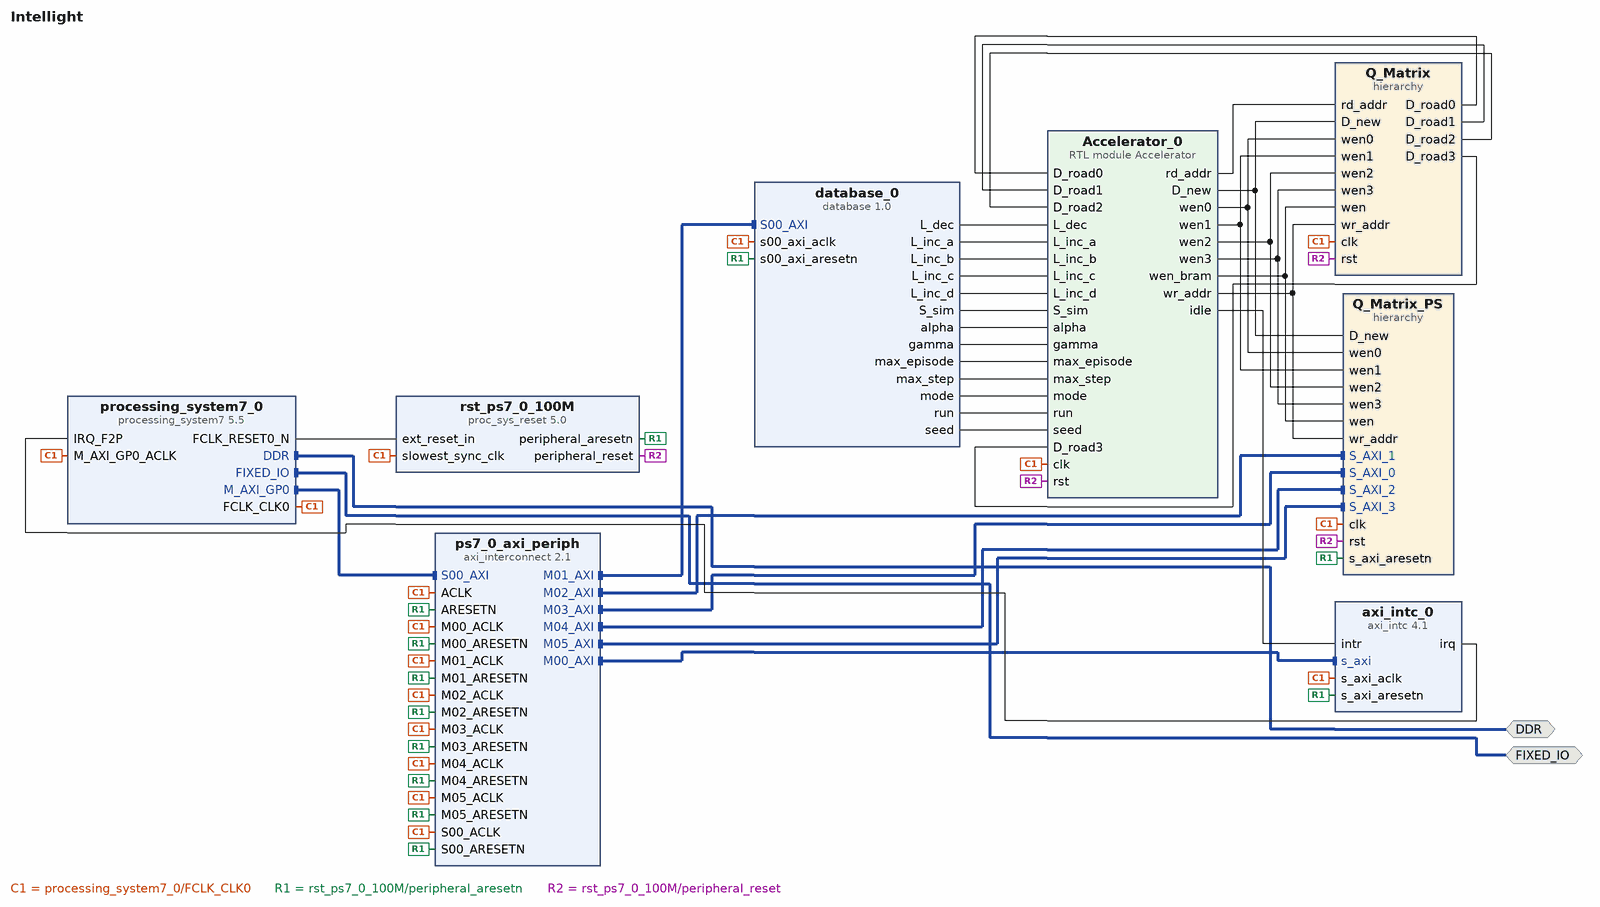
[diagram p0: block diagram of the top level]
# Vivado block design Intellight, xc7z020clg400-1, Vivado 2022.1
create_bd_design Intellight

create_bd_intf_port -mode Master -vlnv xilinx.com:interface:ddrx_rtl:1.0 DDR
create_bd_intf_port -mode Master -vlnv xilinx.com:display_processing_system7:fixedio_rtl:1.0 FIXED_IO

create_bd_cell -type hier Q_Matrix
create_bd_cell -type ip -vlnv xilinx.com:ip:axi_intc:4.1 axi_intc_0
set_property -dict {CONFIG.C_IRQ_CONNECTION 1} [get_bd_cells axi_intc_0]
create_bd_cell -type ip -vlnv xilinx.com:user:database:1.0 database_0
create_bd_cell -type ip -vlnv xilinx.com:ip:processing_system7:5.5 processing_system7_0
set_property -dict [list \
  CONFIG.PCW_APU_PERIPHERAL_FREQMHZ 650 \
  CONFIG.PCW_CRYSTAL_PERIPHERAL_FREQMHZ 50 \
  CONFIG.PCW_ENET0_ENET0_IO {MIO 16 .. 27} \
  CONFIG.PCW_ENET0_GRP_MDIO_ENABLE 1 \
  CONFIG.PCW_ENET0_GRP_MDIO_IO {MIO 52 .. 53} \
  CONFIG.PCW_ENET0_PERIPHERAL_ENABLE 1 \
  CONFIG.PCW_ENET0_RESET_ENABLE 1 \
  CONFIG.PCW_ENET0_RESET_IO {MIO 9} \
  CONFIG.PCW_ENET_RESET_ENABLE 1 \
  CONFIG.PCW_ENET_RESET_SELECT {Share reset pin} \
  CONFIG.PCW_FPGA0_PERIPHERAL_FREQMHZ 100 \
  CONFIG.PCW_FPGA1_PERIPHERAL_FREQMHZ 50 \
  CONFIG.PCW_GPIO_MIO_GPIO_ENABLE 1 \
  CONFIG.PCW_GPIO_MIO_GPIO_IO MIO \
  CONFIG.PCW_I2C_RESET_ENABLE 1 \
  CONFIG.PCW_IRQ_F2P_INTR 1 \
  CONFIG.PCW_M_AXI_GP0_FREQMHZ 10 \
  CONFIG.PCW_PERIPHERAL_BOARD_PRESET None \
  CONFIG.PCW_PRESET_BANK1_VOLTAGE {LVCMOS 1.8V} \
  CONFIG.PCW_QSPI_GRP_FBCLK_ENABLE 1 \
  CONFIG.PCW_QSPI_GRP_FBCLK_IO {MIO 8} \
  CONFIG.PCW_QSPI_GRP_SINGLE_SS_ENABLE 1 \
  CONFIG.PCW_QSPI_GRP_SINGLE_SS_IO {MIO 1 .. 6} \
  CONFIG.PCW_QSPI_PERIPHERAL_ENABLE 1 \
  CONFIG.PCW_QSPI_QSPI_IO {MIO 1 .. 6} \
  CONFIG.PCW_SD0_GRP_CD_ENABLE 1 \
  CONFIG.PCW_SD0_GRP_CD_IO {MIO 47} \
  CONFIG.PCW_SD0_GRP_WP_ENABLE 0 \
  CONFIG.PCW_SD0_PERIPHERAL_ENABLE 1 \
  CONFIG.PCW_SD0_SD0_IO {MIO 40 .. 45} \
  CONFIG.PCW_SDIO_PERIPHERAL_FREQMHZ 50 \
  CONFIG.PCW_SINGLE_QSPI_DATA_MODE x4 \
  CONFIG.PCW_UART0_PERIPHERAL_ENABLE 1 \
  CONFIG.PCW_UART0_UART0_IO {MIO 14 .. 15} \
  CONFIG.PCW_UART1_PERIPHERAL_ENABLE 0 \
  CONFIG.PCW_UART_PERIPHERAL_FREQMHZ 100 \
  CONFIG.PCW_UIPARAM_DDR_BUS_WIDTH {16 Bit} \
  CONFIG.PCW_UIPARAM_DDR_FREQ_MHZ 525 \
  CONFIG.PCW_UIPARAM_DDR_PARTNO {MT41J256M16 RE-125} \
  CONFIG.PCW_USB0_PERIPHERAL_ENABLE 1 \
  CONFIG.PCW_USB0_RESET_ENABLE 1 \
  CONFIG.PCW_USB0_RESET_IO {MIO 46} \
  CONFIG.PCW_USB0_USB0_IO {MIO 28 .. 39} \
  CONFIG.PCW_USB_RESET_ENABLE 1 \
  CONFIG.PCW_USB_RESET_SELECT {Share reset pin} \
  CONFIG.PCW_USE_FABRIC_INTERRUPT 1 \
] [get_bd_cells processing_system7_0]
# 491 more settings of processing_system7_0 are not shown: defaults, MIO pin electricals, DDR timing, and values the tool derives
create_bd_cell -type ip -vlnv xilinx.com:ip:axi_interconnect:2.1 ps7_0_axi_periph
set_property -dict {CONFIG.NUM_MI 6} [get_bd_cells ps7_0_axi_periph]
create_bd_cell -type ip -vlnv xilinx.com:ip:proc_sys_reset:5.0 rst_ps7_0_100M
create_bd_cell -type hier Q_Matrix_PS
create_bd_cell -type module -reference Accelerator Accelerator_0

# ---- hierarchy /Q_Matrix ----
current_bd_instance /Q_Matrix
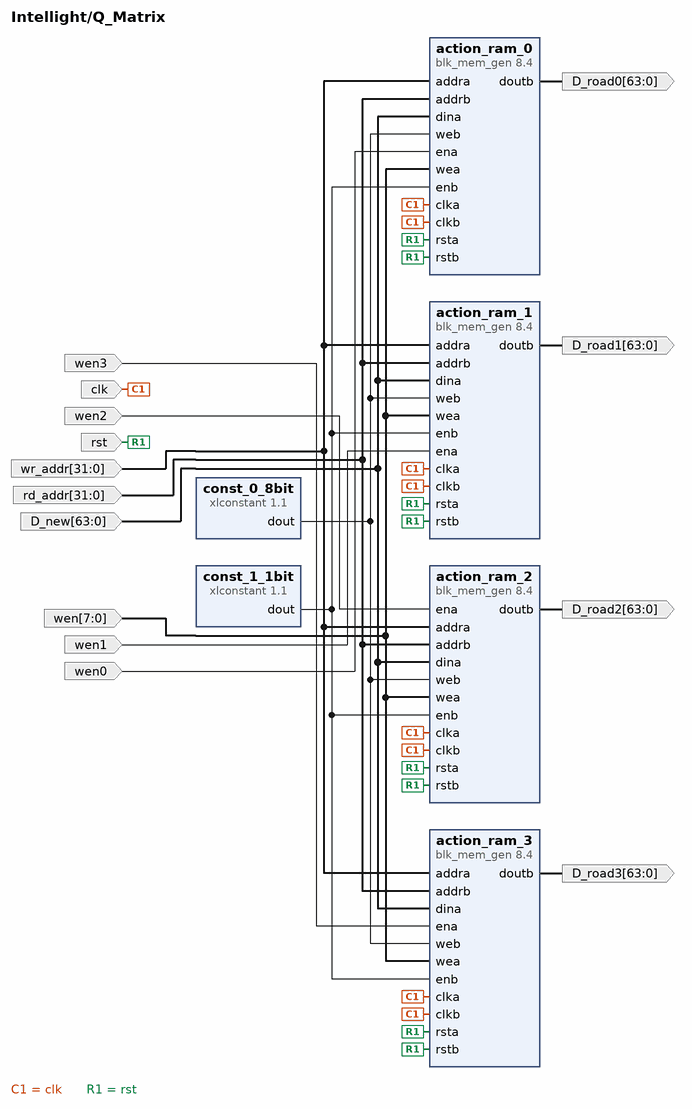
[diagram p1: block diagram inside /Q_Matrix]
create_bd_pin -dir I -type clk clk
create_bd_pin -dir I -type rst rst
create_bd_pin -dir I wen0
create_bd_pin -dir I -from 7 -to 0 wen
create_bd_pin -dir I -from 31 -to 0 wr_addr
create_bd_pin -dir I -from 63 -to 0 D_new
create_bd_pin -dir I -from 31 -to 0 rd_addr
create_bd_pin -dir O -from 63 -to 0 D_road0
create_bd_pin -dir I wen1
create_bd_pin -dir O -from 63 -to 0 D_road1
create_bd_pin -dir I wen2
create_bd_pin -dir O -from 63 -to 0 D_road2
create_bd_pin -dir I wen3
create_bd_pin -dir O -from 63 -to 0 D_road3

create_bd_cell -type ip -vlnv xilinx.com:ip:blk_mem_gen:8.4 action_ram_0
set_property -dict [list \
  CONFIG.Assume_Synchronous_Clk true \
  CONFIG.EN_SAFETY_CKT true \
  CONFIG.Enable_32bit_Address true \
  CONFIG.Enable_B Use_ENB_Pin \
  CONFIG.Memory_Type True_Dual_Port_RAM \
  CONFIG.Operating_Mode_A WRITE_FIRST \
  CONFIG.Operating_Mode_B WRITE_FIRST \
  CONFIG.Port_B_Clock 100 \
  CONFIG.Port_B_Enable_Rate 100 \
  CONFIG.Port_B_Write_Rate 50 \
  CONFIG.Read_Width_A 64 \
  CONFIG.Read_Width_B 64 \
  CONFIG.Register_PortA_Output_of_Memory_Primitives false \
  CONFIG.Register_PortB_Output_of_Memory_Primitives false \
  CONFIG.Use_RSTA_Pin true \
  CONFIG.Use_RSTB_Pin true \
  CONFIG.Write_Depth_A 256 \
  CONFIG.Write_Width_A 64 \
  CONFIG.Write_Width_B 64 \
  CONFIG.use_bram_block Stand_Alone \
] [get_bd_cells action_ram_0]
create_bd_cell -type ip -vlnv xilinx.com:ip:blk_mem_gen:8.4 action_ram_1
set_property -dict [list \
  CONFIG.Assume_Synchronous_Clk true \
  CONFIG.EN_SAFETY_CKT true \
  CONFIG.Enable_32bit_Address true \
  CONFIG.Enable_B Use_ENB_Pin \
  CONFIG.Memory_Type True_Dual_Port_RAM \
  CONFIG.Operating_Mode_A READ_FIRST \
  CONFIG.Operating_Mode_B READ_FIRST \
  CONFIG.Port_B_Clock 100 \
  CONFIG.Port_B_Enable_Rate 100 \
  CONFIG.Port_B_Write_Rate 50 \
  CONFIG.Read_Width_A 64 \
  CONFIG.Read_Width_B 64 \
  CONFIG.Register_PortA_Output_of_Memory_Primitives false \
  CONFIG.Register_PortB_Output_of_Memory_Primitives false \
  CONFIG.Use_RSTA_Pin true \
  CONFIG.Use_RSTB_Pin true \
  CONFIG.Write_Depth_A 256 \
  CONFIG.Write_Width_A 64 \
  CONFIG.Write_Width_B 64 \
  CONFIG.use_bram_block Stand_Alone \
] [get_bd_cells action_ram_1]
create_bd_cell -type ip -vlnv xilinx.com:ip:blk_mem_gen:8.4 action_ram_2
set_property -dict [list \
  CONFIG.Assume_Synchronous_Clk true \
  CONFIG.EN_SAFETY_CKT true \
  CONFIG.Enable_32bit_Address true \
  CONFIG.Enable_B Use_ENB_Pin \
  CONFIG.Memory_Type True_Dual_Port_RAM \
  CONFIG.Operating_Mode_A READ_FIRST \
  CONFIG.Operating_Mode_B READ_FIRST \
  CONFIG.Port_B_Clock 100 \
  CONFIG.Port_B_Enable_Rate 100 \
  CONFIG.Port_B_Write_Rate 50 \
  CONFIG.Read_Width_A 64 \
  CONFIG.Read_Width_B 64 \
  CONFIG.Register_PortA_Output_of_Memory_Primitives false \
  CONFIG.Register_PortB_Output_of_Memory_Primitives false \
  CONFIG.Use_RSTA_Pin true \
  CONFIG.Use_RSTB_Pin true \
  CONFIG.Write_Depth_A 256 \
  CONFIG.Write_Width_A 64 \
  CONFIG.Write_Width_B 64 \
  CONFIG.use_bram_block Stand_Alone \
] [get_bd_cells action_ram_2]
create_bd_cell -type ip -vlnv xilinx.com:ip:blk_mem_gen:8.4 action_ram_3
set_property -dict [list \
  CONFIG.Assume_Synchronous_Clk true \
  CONFIG.EN_SAFETY_CKT true \
  CONFIG.Enable_32bit_Address true \
  CONFIG.Enable_B Use_ENB_Pin \
  CONFIG.Memory_Type True_Dual_Port_RAM \
  CONFIG.Operating_Mode_A READ_FIRST \
  CONFIG.Operating_Mode_B READ_FIRST \
  CONFIG.Port_B_Clock 100 \
  CONFIG.Port_B_Enable_Rate 100 \
  CONFIG.Port_B_Write_Rate 50 \
  CONFIG.Read_Width_A 64 \
  CONFIG.Read_Width_B 64 \
  CONFIG.Register_PortA_Output_of_Memory_Primitives false \
  CONFIG.Register_PortB_Output_of_Memory_Primitives false \
  CONFIG.Use_RSTA_Pin true \
  CONFIG.Use_RSTB_Pin true \
  CONFIG.Write_Depth_A 256 \
  CONFIG.Write_Width_A 64 \
  CONFIG.Write_Width_B 64 \
  CONFIG.use_bram_block Stand_Alone \
] [get_bd_cells action_ram_3]
create_bd_cell -type ip -vlnv xilinx.com:ip:xlconstant:1.1 const_1_1bit
create_bd_cell -type ip -vlnv xilinx.com:ip:xlconstant:1.1 const_0_8bit
set_property -dict {CONFIG.CONST_VAL 0 CONFIG.CONST_WIDTH 8} [get_bd_cells const_0_8bit]

# ---- hierarchy /Q_Matrix_PS ----
current_bd_instance /Q_Matrix_PS
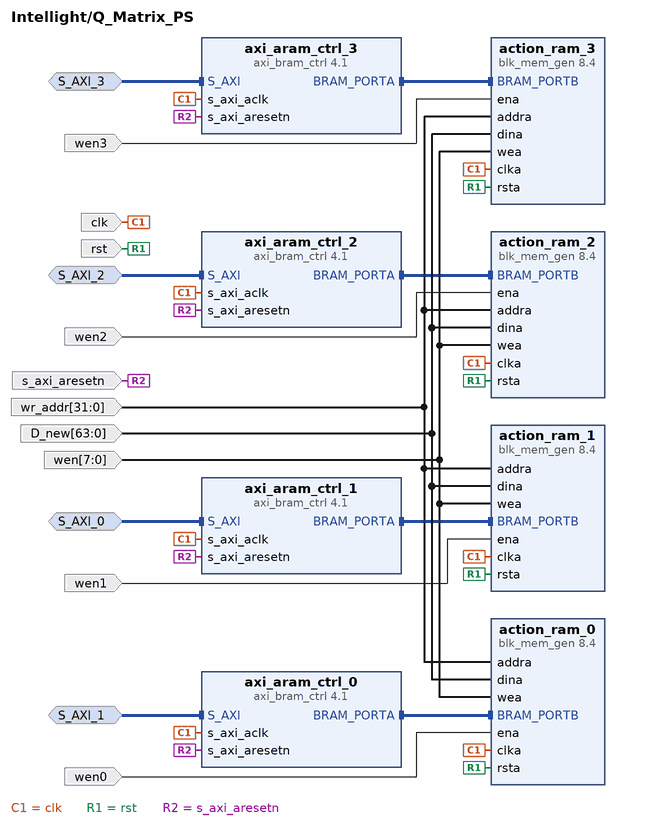
[diagram p2: block diagram inside /Q_Matrix_PS]
create_bd_intf_pin -mode Slave -vlnv xilinx.com:interface:aximm_rtl:1.0 S_AXI_0
create_bd_intf_pin -mode Slave -vlnv xilinx.com:interface:aximm_rtl:1.0 S_AXI_1
create_bd_intf_pin -mode Slave -vlnv xilinx.com:interface:aximm_rtl:1.0 S_AXI_2
create_bd_intf_pin -mode Slave -vlnv xilinx.com:interface:aximm_rtl:1.0 S_AXI_3
create_bd_pin -dir I -from 63 -to 0 D_new
create_bd_pin -dir I -type clk clk
create_bd_pin -dir I -type rst rst
create_bd_pin -dir I -type rst s_axi_aresetn
create_bd_pin -dir I -from 7 -to 0 wen
create_bd_pin -dir I wen0
create_bd_pin -dir I wen1
create_bd_pin -dir I wen2
create_bd_pin -dir I wen3
create_bd_pin -dir I -from 31 -to 0 wr_addr

create_bd_cell -type ip -vlnv xilinx.com:ip:blk_mem_gen:8.4 action_ram_0
set_property -dict [list \
  CONFIG.Assume_Synchronous_Clk true \
  CONFIG.EN_SAFETY_CKT true \
  CONFIG.Enable_32bit_Address true \
  CONFIG.Enable_B Use_ENB_Pin \
  CONFIG.Memory_Type True_Dual_Port_RAM \
  CONFIG.Operating_Mode_A WRITE_FIRST \
  CONFIG.Operating_Mode_B WRITE_FIRST \
  CONFIG.Port_B_Clock 100 \
  CONFIG.Port_B_Enable_Rate 100 \
  CONFIG.Port_B_Write_Rate 50 \
  CONFIG.Read_Width_A 64 \
  CONFIG.Read_Width_B 64 \
  CONFIG.Register_PortA_Output_of_Memory_Primitives false \
  CONFIG.Register_PortB_Output_of_Memory_Primitives false \
  CONFIG.Use_RSTA_Pin true \
  CONFIG.Use_RSTB_Pin true \
  CONFIG.Write_Width_A 64 \
  CONFIG.Write_Width_B 64 \
  CONFIG.use_bram_block BRAM_Controller \
] [get_bd_cells action_ram_0]
create_bd_cell -type ip -vlnv xilinx.com:ip:blk_mem_gen:8.4 action_ram_1
set_property -dict [list \
  CONFIG.Assume_Synchronous_Clk true \
  CONFIG.EN_SAFETY_CKT true \
  CONFIG.Enable_32bit_Address true \
  CONFIG.Enable_B Use_ENB_Pin \
  CONFIG.Memory_Type True_Dual_Port_RAM \
  CONFIG.Operating_Mode_A WRITE_FIRST \
  CONFIG.Operating_Mode_B WRITE_FIRST \
  CONFIG.Port_B_Clock 100 \
  CONFIG.Port_B_Enable_Rate 100 \
  CONFIG.Port_B_Write_Rate 50 \
  CONFIG.Read_Width_A 64 \
  CONFIG.Read_Width_B 64 \
  CONFIG.Register_PortA_Output_of_Memory_Primitives false \
  CONFIG.Register_PortB_Output_of_Memory_Primitives false \
  CONFIG.Use_RSTA_Pin true \
  CONFIG.Use_RSTB_Pin true \
  CONFIG.Write_Width_A 64 \
  CONFIG.Write_Width_B 64 \
  CONFIG.use_bram_block BRAM_Controller \
] [get_bd_cells action_ram_1]
create_bd_cell -type ip -vlnv xilinx.com:ip:blk_mem_gen:8.4 action_ram_2
set_property -dict [list \
  CONFIG.Assume_Synchronous_Clk true \
  CONFIG.EN_SAFETY_CKT true \
  CONFIG.Enable_32bit_Address true \
  CONFIG.Enable_B Use_ENB_Pin \
  CONFIG.Memory_Type True_Dual_Port_RAM \
  CONFIG.Operating_Mode_A WRITE_FIRST \
  CONFIG.Operating_Mode_B WRITE_FIRST \
  CONFIG.Port_B_Clock 100 \
  CONFIG.Port_B_Enable_Rate 100 \
  CONFIG.Port_B_Write_Rate 50 \
  CONFIG.Read_Width_A 64 \
  CONFIG.Read_Width_B 64 \
  CONFIG.Register_PortA_Output_of_Memory_Primitives false \
  CONFIG.Register_PortB_Output_of_Memory_Primitives false \
  CONFIG.Use_RSTA_Pin true \
  CONFIG.Use_RSTB_Pin true \
  CONFIG.Write_Width_A 64 \
  CONFIG.Write_Width_B 64 \
  CONFIG.use_bram_block BRAM_Controller \
] [get_bd_cells action_ram_2]
create_bd_cell -type ip -vlnv xilinx.com:ip:blk_mem_gen:8.4 action_ram_3
set_property -dict [list \
  CONFIG.Assume_Synchronous_Clk true \
  CONFIG.EN_SAFETY_CKT true \
  CONFIG.Enable_32bit_Address true \
  CONFIG.Enable_B Use_ENB_Pin \
  CONFIG.Memory_Type True_Dual_Port_RAM \
  CONFIG.Operating_Mode_A WRITE_FIRST \
  CONFIG.Operating_Mode_B WRITE_FIRST \
  CONFIG.Port_B_Clock 100 \
  CONFIG.Port_B_Enable_Rate 100 \
  CONFIG.Port_B_Write_Rate 50 \
  CONFIG.Read_Width_A 64 \
  CONFIG.Read_Width_B 64 \
  CONFIG.Register_PortA_Output_of_Memory_Primitives false \
  CONFIG.Register_PortB_Output_of_Memory_Primitives false \
  CONFIG.Use_RSTA_Pin true \
  CONFIG.Use_RSTB_Pin true \
  CONFIG.Write_Width_A 64 \
  CONFIG.Write_Width_B 64 \
  CONFIG.use_bram_block BRAM_Controller \
] [get_bd_cells action_ram_3]
create_bd_cell -type ip -vlnv xilinx.com:ip:axi_bram_ctrl:4.1 axi_aram_ctrl_0
set_property -dict {CONFIG.DATA_WIDTH 64 CONFIG.SINGLE_PORT_BRAM 1} [get_bd_cells axi_aram_ctrl_0]
create_bd_cell -type ip -vlnv xilinx.com:ip:axi_bram_ctrl:4.1 axi_aram_ctrl_1
set_property -dict {CONFIG.DATA_WIDTH 64 CONFIG.SINGLE_PORT_BRAM 1} [get_bd_cells axi_aram_ctrl_1]
create_bd_cell -type ip -vlnv xilinx.com:ip:axi_bram_ctrl:4.1 axi_aram_ctrl_2
set_property -dict {CONFIG.DATA_WIDTH 64 CONFIG.SINGLE_PORT_BRAM 1} [get_bd_cells axi_aram_ctrl_2]
create_bd_cell -type ip -vlnv xilinx.com:ip:axi_bram_ctrl:4.1 axi_aram_ctrl_3
set_property -dict {CONFIG.DATA_WIDTH 64 CONFIG.SINGLE_PORT_BRAM 1} [get_bd_cells axi_aram_ctrl_3]

# ---- connections ----

current_bd_instance /Q_Matrix
connect_bd_net [get_bd_pins action_ram_0/doutb] [get_bd_pins D_road0]
connect_bd_net [get_bd_pins action_ram_1/doutb] [get_bd_pins D_road1]
connect_bd_net [get_bd_pins action_ram_2/doutb] [get_bd_pins D_road2]
connect_bd_net [get_bd_pins action_ram_3/doutb] [get_bd_pins D_road3]
connect_bd_net -net addra_0_1 [get_bd_pins wr_addr] \
  [get_bd_pins action_ram_1/addra] [get_bd_pins action_ram_2/addra] [get_bd_pins action_ram_3/addra] \
  [get_bd_pins action_ram_0/addra]
connect_bd_net -net addrb_0_1 [get_bd_pins rd_addr] \
  [get_bd_pins action_ram_1/addrb] [get_bd_pins action_ram_2/addrb] [get_bd_pins action_ram_3/addrb] \
  [get_bd_pins action_ram_0/addrb]
connect_bd_net -net clka_0_1 [get_bd_pins clk] \
  [get_bd_pins action_ram_0/clkb] [get_bd_pins action_ram_1/clka] [get_bd_pins action_ram_1/clkb] \
  [get_bd_pins action_ram_2/clka] [get_bd_pins action_ram_2/clkb] [get_bd_pins action_ram_3/clka] \
  [get_bd_pins action_ram_3/clkb] [get_bd_pins action_ram_0/clka]
connect_bd_net -net const_0_4bit_dout [get_bd_pins const_0_8bit/dout] \
  [get_bd_pins action_ram_0/web] [get_bd_pins action_ram_1/web] [get_bd_pins action_ram_2/web] [get_bd_pins action_ram_3/web]
connect_bd_net -net dina_0_1 [get_bd_pins D_new] \
  [get_bd_pins action_ram_1/dina] [get_bd_pins action_ram_2/dina] [get_bd_pins action_ram_3/dina] \
  [get_bd_pins action_ram_0/dina]
connect_bd_net -net rsta_0_1 [get_bd_pins rst] \
  [get_bd_pins action_ram_0/rstb] [get_bd_pins action_ram_1/rsta] [get_bd_pins action_ram_1/rstb] \
  [get_bd_pins action_ram_2/rsta] [get_bd_pins action_ram_2/rstb] [get_bd_pins action_ram_3/rsta] \
  [get_bd_pins action_ram_3/rstb] [get_bd_pins action_ram_0/rsta]
connect_bd_net -net wea_0_1 [get_bd_pins wen] \
  [get_bd_pins action_ram_1/wea] [get_bd_pins action_ram_2/wea] [get_bd_pins action_ram_3/wea] [get_bd_pins action_ram_0/wea]
connect_bd_net -net wen0_1 [get_bd_pins wen0] [get_bd_pins action_ram_0/ena]
connect_bd_net -net wen1_1 [get_bd_pins wen1] [get_bd_pins action_ram_1/ena]
connect_bd_net -net wen2_1 [get_bd_pins wen2] [get_bd_pins action_ram_2/ena]
connect_bd_net -net wen3_1 [get_bd_pins wen3] [get_bd_pins action_ram_3/ena]
connect_bd_net -net xlconstant_0_dout [get_bd_pins const_1_1bit/dout] \
  [get_bd_pins action_ram_0/enb] [get_bd_pins action_ram_1/enb] [get_bd_pins action_ram_2/enb] [get_bd_pins action_ram_3/enb]

current_bd_instance /Q_Matrix_PS
connect_bd_intf_net -intf_net S_AXI_0_1 [get_bd_intf_pins S_AXI_0] [get_bd_intf_pins axi_aram_ctrl_1/S_AXI]
connect_bd_intf_net -intf_net S_AXI_1_1 [get_bd_intf_pins S_AXI_1] [get_bd_intf_pins axi_aram_ctrl_0/S_AXI]
connect_bd_intf_net -intf_net S_AXI_2_1 [get_bd_intf_pins S_AXI_2] [get_bd_intf_pins axi_aram_ctrl_2/S_AXI]
connect_bd_intf_net -intf_net S_AXI_3_1 [get_bd_intf_pins S_AXI_3] [get_bd_intf_pins axi_aram_ctrl_3/S_AXI]
connect_bd_intf_net [get_bd_intf_pins action_ram_0/BRAM_PORTB] [get_bd_intf_pins axi_aram_ctrl_0/BRAM_PORTA]
connect_bd_intf_net [get_bd_intf_pins action_ram_1/BRAM_PORTB] [get_bd_intf_pins axi_aram_ctrl_1/BRAM_PORTA]
connect_bd_intf_net [get_bd_intf_pins action_ram_2/BRAM_PORTB] [get_bd_intf_pins axi_aram_ctrl_2/BRAM_PORTA]
connect_bd_intf_net [get_bd_intf_pins action_ram_3/BRAM_PORTB] [get_bd_intf_pins axi_aram_ctrl_3/BRAM_PORTA]
connect_bd_net -net addra_0_1 [get_bd_pins wr_addr] \
  [get_bd_pins action_ram_0/addra] [get_bd_pins action_ram_1/addra] [get_bd_pins action_ram_2/addra] \
  [get_bd_pins action_ram_3/addra]
connect_bd_net -net clka_0_1 [get_bd_pins clk] \
  [get_bd_pins action_ram_0/clka] [get_bd_pins action_ram_1/clka] [get_bd_pins action_ram_2/clka] \
  [get_bd_pins action_ram_3/clka] [get_bd_pins axi_aram_ctrl_0/s_axi_aclk] [get_bd_pins axi_aram_ctrl_1/s_axi_aclk] \
  [get_bd_pins axi_aram_ctrl_2/s_axi_aclk] [get_bd_pins axi_aram_ctrl_3/s_axi_aclk]
connect_bd_net -net dina_0_1 [get_bd_pins D_new] \
  [get_bd_pins action_ram_0/dina] [get_bd_pins action_ram_1/dina] [get_bd_pins action_ram_2/dina] \
  [get_bd_pins action_ram_3/dina]
connect_bd_net -net rsta_0_1 [get_bd_pins rst] \
  [get_bd_pins action_ram_0/rsta] [get_bd_pins action_ram_1/rsta] [get_bd_pins action_ram_2/rsta] \
  [get_bd_pins action_ram_3/rsta]
connect_bd_net [get_bd_pins s_axi_aresetn] \
  [get_bd_pins axi_aram_ctrl_0/s_axi_aresetn] [get_bd_pins axi_aram_ctrl_1/s_axi_aresetn] \
  [get_bd_pins axi_aram_ctrl_2/s_axi_aresetn] [get_bd_pins axi_aram_ctrl_3/s_axi_aresetn]
connect_bd_net -net wea_0_1 [get_bd_pins wen] \
  [get_bd_pins action_ram_0/wea] [get_bd_pins action_ram_1/wea] [get_bd_pins action_ram_2/wea] [get_bd_pins action_ram_3/wea]
connect_bd_net -net wen0_1 [get_bd_pins wen0] [get_bd_pins action_ram_0/ena]
connect_bd_net -net wen1_1 [get_bd_pins wen1] [get_bd_pins action_ram_1/ena]
connect_bd_net -net wen2_1 [get_bd_pins wen2] [get_bd_pins action_ram_2/ena]
connect_bd_net -net wen3_1 [get_bd_pins wen3] [get_bd_pins action_ram_3/ena]
set_property HDL_ATTRIBUTE.BMM_INFO_ADDRESS_SPACE {byte  0x40000000 64 > Intellight Q_Matrix_PS/action_ram_0} [get_bd_cells axi_aram_ctrl_0]
set_property HDL_ATTRIBUTE.KEEP_HIERARCHY yes [get_bd_cells axi_aram_ctrl_0]
set_property HDL_ATTRIBUTE.BMM_INFO_ADDRESS_SPACE {byte  0x42000000 64 > Intellight Q_Matrix_PS/action_ram_1} [get_bd_cells axi_aram_ctrl_1]
set_property HDL_ATTRIBUTE.KEEP_HIERARCHY yes [get_bd_cells axi_aram_ctrl_1]
set_property HDL_ATTRIBUTE.BMM_INFO_ADDRESS_SPACE {byte  0x44000000 64 > Intellight Q_Matrix_PS/action_ram_2} [get_bd_cells axi_aram_ctrl_2]
set_property HDL_ATTRIBUTE.KEEP_HIERARCHY yes [get_bd_cells axi_aram_ctrl_2]
set_property HDL_ATTRIBUTE.BMM_INFO_ADDRESS_SPACE {byte  0x46000000 64 > Intellight Q_Matrix_PS/action_ram_3} [get_bd_cells axi_aram_ctrl_3]
set_property HDL_ATTRIBUTE.KEEP_HIERARCHY yes [get_bd_cells axi_aram_ctrl_3]

current_bd_instance /
connect_bd_intf_net [get_bd_intf_ports DDR] [get_bd_intf_pins processing_system7_0/DDR]
connect_bd_intf_net [get_bd_intf_ports FIXED_IO] [get_bd_intf_pins processing_system7_0/FIXED_IO]
connect_bd_intf_net [get_bd_intf_pins processing_system7_0/M_AXI_GP0] [get_bd_intf_pins ps7_0_axi_periph/S00_AXI]
connect_bd_intf_net [get_bd_intf_pins ps7_0_axi_periph/M00_AXI] [get_bd_intf_pins axi_intc_0/s_axi]
connect_bd_intf_net [get_bd_intf_pins ps7_0_axi_periph/M01_AXI] [get_bd_intf_pins database_0/S00_AXI]
connect_bd_intf_net [get_bd_intf_pins ps7_0_axi_periph/M02_AXI] [get_bd_intf_pins Q_Matrix_PS/S_AXI_1]
connect_bd_intf_net [get_bd_intf_pins ps7_0_axi_periph/M03_AXI] [get_bd_intf_pins Q_Matrix_PS/S_AXI_0]
connect_bd_intf_net [get_bd_intf_pins ps7_0_axi_periph/M04_AXI] [get_bd_intf_pins Q_Matrix_PS/S_AXI_2]
connect_bd_intf_net [get_bd_intf_pins ps7_0_axi_periph/M05_AXI] [get_bd_intf_pins Q_Matrix_PS/S_AXI_3]
connect_bd_net [get_bd_pins Accelerator_0/D_new] [get_bd_pins Q_Matrix/D_new] [get_bd_pins Q_Matrix_PS/D_new]
connect_bd_net [get_bd_pins Accelerator_0/idle] [get_bd_pins axi_intc_0/intr]
connect_bd_net [get_bd_pins Accelerator_0/rd_addr] [get_bd_pins Q_Matrix/rd_addr]
connect_bd_net [get_bd_pins Accelerator_0/wen0] [get_bd_pins Q_Matrix/wen0] [get_bd_pins Q_Matrix_PS/wen0]
connect_bd_net [get_bd_pins Accelerator_0/wen1] [get_bd_pins Q_Matrix/wen1] [get_bd_pins Q_Matrix_PS/wen1]
connect_bd_net [get_bd_pins Accelerator_0/wen2] [get_bd_pins Q_Matrix/wen2] [get_bd_pins Q_Matrix_PS/wen2]
connect_bd_net [get_bd_pins Accelerator_0/wen3] [get_bd_pins Q_Matrix/wen3] [get_bd_pins Q_Matrix_PS/wen3]
connect_bd_net [get_bd_pins Accelerator_0/wen_bram] [get_bd_pins Q_Matrix/wen] [get_bd_pins Q_Matrix_PS/wen]
connect_bd_net [get_bd_pins Accelerator_0/wr_addr] [get_bd_pins Q_Matrix/wr_addr] [get_bd_pins Q_Matrix_PS/wr_addr]
connect_bd_net -net action_ram_0_doutb [get_bd_pins Q_Matrix/D_road0] [get_bd_pins Accelerator_0/D_road0]
connect_bd_net -net action_ram_1_doutb [get_bd_pins Q_Matrix/D_road1] [get_bd_pins Accelerator_0/D_road1]
connect_bd_net -net action_ram_2_doutb [get_bd_pins Q_Matrix/D_road2] [get_bd_pins Accelerator_0/D_road2]
connect_bd_net -net action_ram_3_doutb [get_bd_pins Q_Matrix/D_road3] [get_bd_pins Accelerator_0/D_road3]
connect_bd_net [get_bd_pins axi_intc_0/irq] [get_bd_pins processing_system7_0/IRQ_F2P]
connect_bd_net [get_bd_pins database_0/L_dec] [get_bd_pins Accelerator_0/L_dec]
connect_bd_net [get_bd_pins database_0/L_inc_a] [get_bd_pins Accelerator_0/L_inc_a]
connect_bd_net [get_bd_pins database_0/L_inc_b] [get_bd_pins Accelerator_0/L_inc_b]
connect_bd_net [get_bd_pins database_0/L_inc_c] [get_bd_pins Accelerator_0/L_inc_c]
connect_bd_net [get_bd_pins database_0/L_inc_d] [get_bd_pins Accelerator_0/L_inc_d]
connect_bd_net [get_bd_pins database_0/S_sim] [get_bd_pins Accelerator_0/S_sim]
connect_bd_net [get_bd_pins database_0/alpha] [get_bd_pins Accelerator_0/alpha]
connect_bd_net [get_bd_pins database_0/gamma] [get_bd_pins Accelerator_0/gamma]
connect_bd_net [get_bd_pins database_0/max_episode] [get_bd_pins Accelerator_0/max_episode]
connect_bd_net [get_bd_pins database_0/max_step] [get_bd_pins Accelerator_0/max_step]
connect_bd_net [get_bd_pins database_0/mode] [get_bd_pins Accelerator_0/mode]
connect_bd_net [get_bd_pins database_0/run] [get_bd_pins Accelerator_0/run]
connect_bd_net [get_bd_pins database_0/seed] [get_bd_pins Accelerator_0/seed]
connect_bd_net [get_bd_pins processing_system7_0/FCLK_CLK0] \
  [get_bd_pins processing_system7_0/M_AXI_GP0_ACLK] [get_bd_pins ps7_0_axi_periph/S00_ACLK] \
  [get_bd_pins rst_ps7_0_100M/slowest_sync_clk] [get_bd_pins axi_intc_0/s_axi_aclk] [get_bd_pins ps7_0_axi_periph/M00_ACLK] \
  [get_bd_pins ps7_0_axi_periph/ACLK] [get_bd_pins database_0/s00_axi_aclk] [get_bd_pins ps7_0_axi_periph/M01_ACLK] \
  [get_bd_pins Q_Matrix/clk] [get_bd_pins Q_Matrix_PS/clk] [get_bd_pins ps7_0_axi_periph/M02_ACLK] \
  [get_bd_pins ps7_0_axi_periph/M03_ACLK] [get_bd_pins ps7_0_axi_periph/M04_ACLK] [get_bd_pins ps7_0_axi_periph/M05_ACLK] \
  [get_bd_pins Accelerator_0/clk]
connect_bd_net [get_bd_pins processing_system7_0/FCLK_RESET0_N] [get_bd_pins rst_ps7_0_100M/ext_reset_in]
connect_bd_net [get_bd_pins rst_ps7_0_100M/peripheral_aresetn] \
  [get_bd_pins ps7_0_axi_periph/S00_ARESETN] [get_bd_pins axi_intc_0/s_axi_aresetn] \
  [get_bd_pins ps7_0_axi_periph/M00_ARESETN] [get_bd_pins ps7_0_axi_periph/ARESETN] [get_bd_pins database_0/s00_axi_aresetn] \
  [get_bd_pins ps7_0_axi_periph/M01_ARESETN] [get_bd_pins Q_Matrix_PS/s_axi_aresetn] \
  [get_bd_pins ps7_0_axi_periph/M02_ARESETN] [get_bd_pins ps7_0_axi_periph/M03_ARESETN] \
  [get_bd_pins ps7_0_axi_periph/M04_ARESETN] [get_bd_pins ps7_0_axi_periph/M05_ARESETN]
connect_bd_net -net rsta_0_1 [get_bd_pins rst_ps7_0_100M/peripheral_reset] \
  [get_bd_pins Q_Matrix/rst] [get_bd_pins Q_Matrix_PS/rst] [get_bd_pins Accelerator_0/rst]
set_property HDL_ATTRIBUTE.BMM_INFO_PROCESSOR {arm > Intellight Q_Matrix_PS/axi_aram_ctrl_0 Intellight Q_Matrix_PS/axi_aram_ctrl_1 Intellight Q_Matrix_PS/axi_aram_ctrl_2 Intellight Q_Matrix_PS/axi_aram_ctrl_3} [get_bd_cells processing_system7_0]
set_property HDL_ATTRIBUTE.KEEP_HIERARCHY yes [get_bd_cells processing_system7_0]

# ---- address map ----
assign_bd_address -offset 0x40000000 -range 8K -target_address_space [get_bd_addr_spaces processing_system7_0/Data] [get_bd_addr_segs Q_Matrix_PS/axi_aram_ctrl_0/S_AXI/Mem0]
assign_bd_address -offset 0x41800000 -range 64K -target_address_space [get_bd_addr_spaces processing_system7_0/Data] [get_bd_addr_segs axi_intc_0/S_AXI/Reg]
assign_bd_address -offset 0x42000000 -range 8K -target_address_space [get_bd_addr_spaces processing_system7_0/Data] [get_bd_addr_segs Q_Matrix_PS/axi_aram_ctrl_1/S_AXI/Mem0]
assign_bd_address -offset 0x43C00000 -range 64K -target_address_space [get_bd_addr_spaces processing_system7_0/Data] [get_bd_addr_segs database_0/S00_AXI/S00_AXI_reg]
assign_bd_address -offset 0x44000000 -range 8K -target_address_space [get_bd_addr_spaces processing_system7_0/Data] [get_bd_addr_segs Q_Matrix_PS/axi_aram_ctrl_2/S_AXI/Mem0]
assign_bd_address -offset 0x46000000 -range 8K -target_address_space [get_bd_addr_spaces processing_system7_0/Data] [get_bd_addr_segs Q_Matrix_PS/axi_aram_ctrl_3/S_AXI/Mem0]

validate_bd_design
save_bd_design
